# EAGLE design MOD-WiFi-ESP8266-DEV_Rev_B1 (EAGLE 4.16)
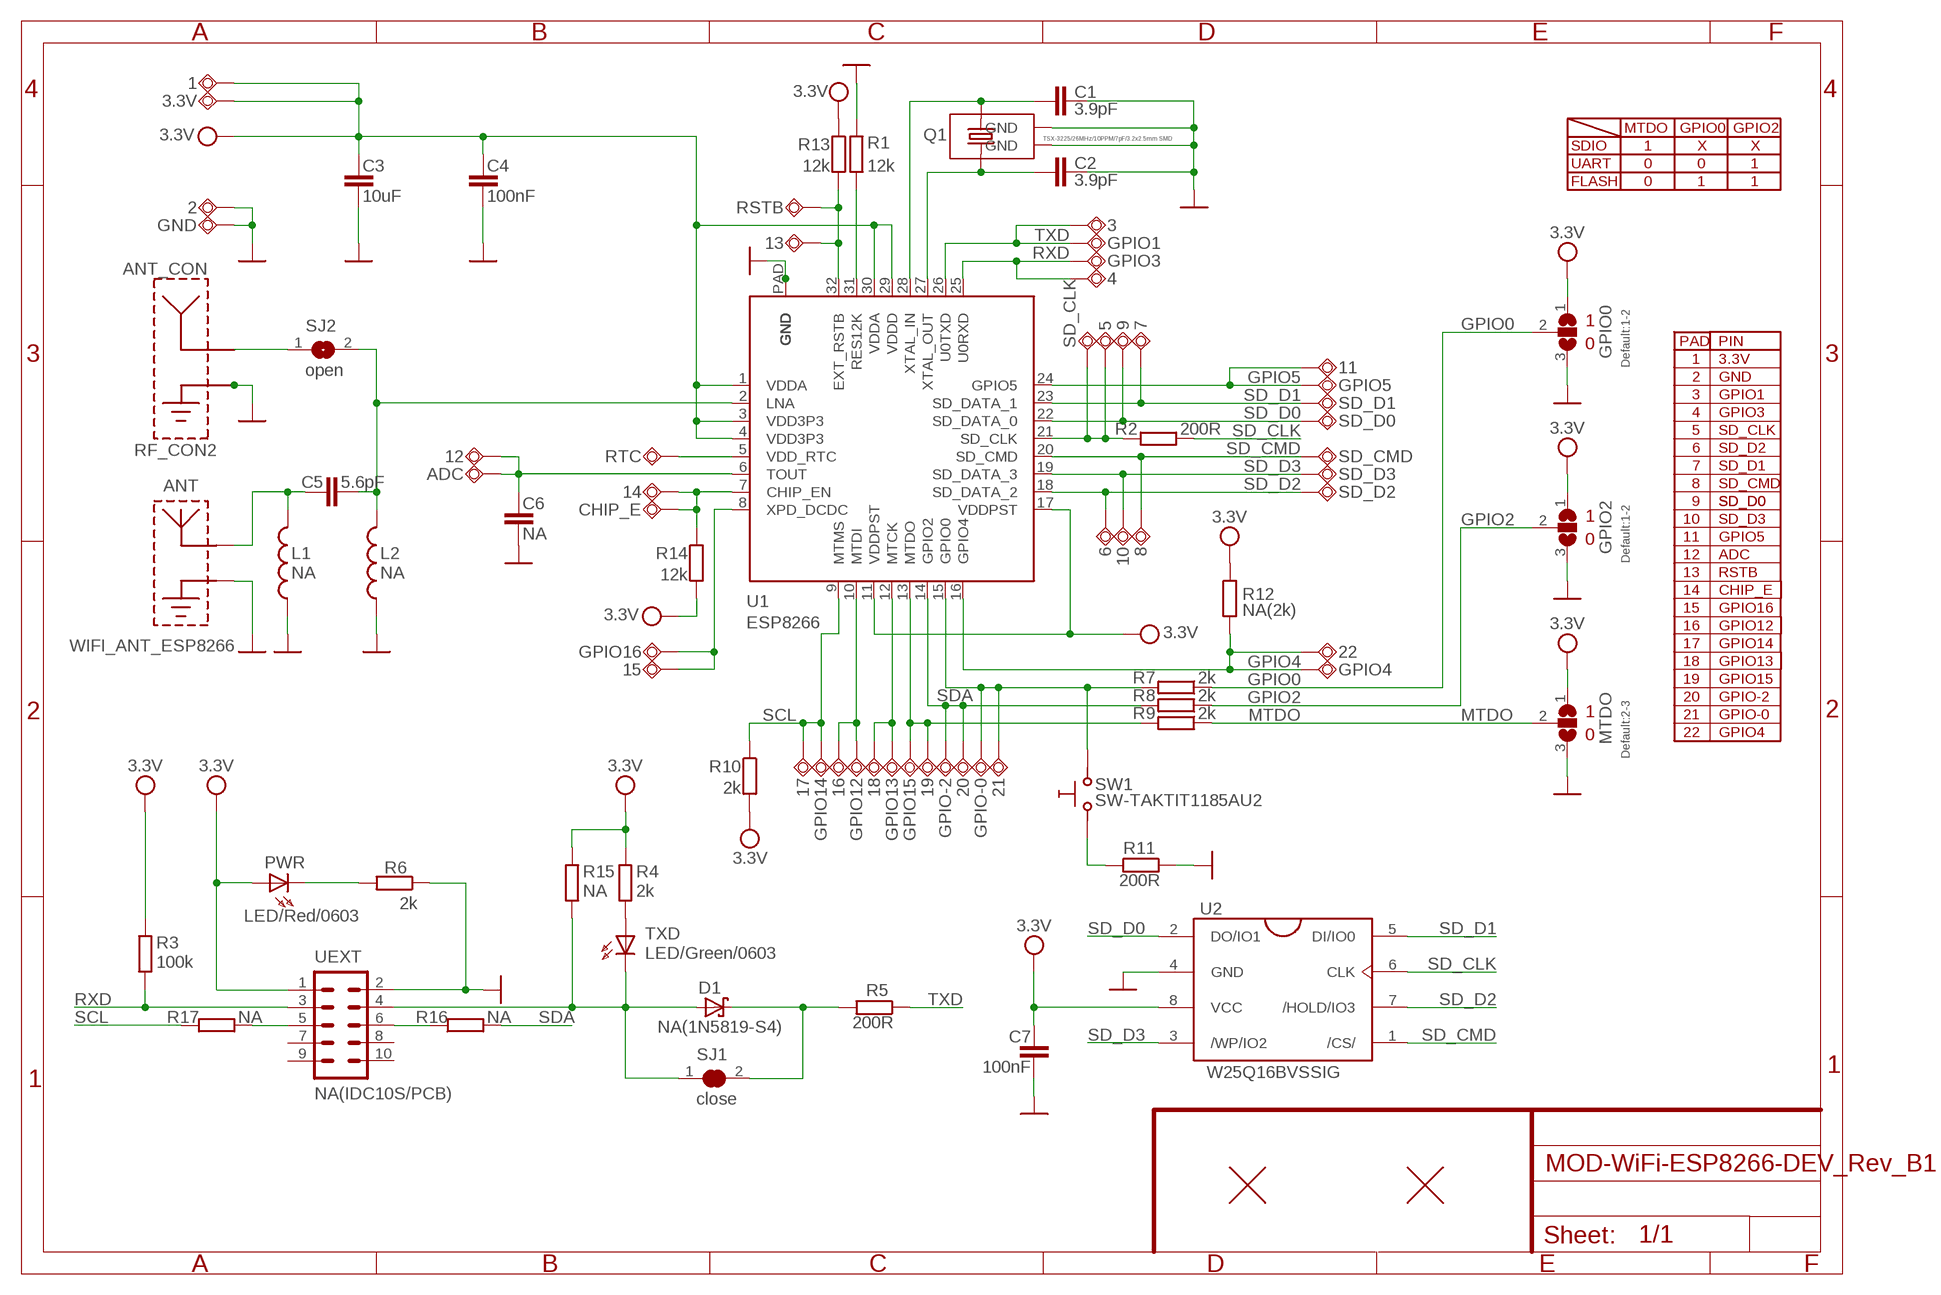
[diagram p0: schematic, sheet 1]

## Parts
1  TESTPAD8  [TESTPAD50/80]
2  TESTPAD8  [TESTPAD50/80]
3  TESTPAD8  [TESTPAD50/80]
3.3V  TESTPAD40/66  [TESTPAD40/66]
4  TESTPAD8  [TESTPAD50/80]
5  TESTPAD8  [TESTPAD50/80]
6  TESTPAD8  [TESTPAD50/80]
7  TESTPAD8  [TESTPAD50/80]
8  TESTPAD8  [TESTPAD50/80]
9  TESTPAD8  [TESTPAD50/80]
10  TESTPAD8  [TESTPAD50/80]
11  TESTPAD8  [TESTPAD50/80]
12  TESTPAD8  [TESTPAD50/80]
13  TESTPAD8  [TESTPAD50/80]
14  TESTPAD8  [TESTPAD50/80]
15  TESTPAD8  [TESTPAD50/80]
16  TESTPAD8  [TESTPAD50/80]
17  TESTPAD8  [TESTPAD50/80]
18  TESTPAD8  [TESTPAD50/80]
19  TESTPAD8  [TESTPAD50/80]
20  TESTPAD8  [TESTPAD50/80]
21  TESTPAD8  [TESTPAD50/80]
22  TESTPAD8  [TESTPAD50/80]
ADC  TESTPAD40/66  [TESTPAD40/66]
ANT  WIFI_ANT_ESP8266  [ESP8266_ANT]
ANT_CON  RF_CON2  [RF_CONNECTOR_I-PEX_NO_CREAM]
C1  3.9pF  C-EUC0402_TI  [C0402_TI]
C2  3.9pF  C-EUC0402_TI  [C0402_TI]
C3  10uF  C-EUC0603_DWS  [C0603_DWS]
C4  100nF  C-EUC0402_TI  [C0402_TI]
C5  5.6pF  C-EUC0402_TI  [C0402_TI]
C6  NA  C-EUC0402_TI  [C0402_TI]
C7  100nF  C-EUC0402_TI  [C0402_TI]
CHIP_E  TESTPAD40/66  [TESTPAD40/66]
D1  NA(1N5819-S4)  SCHOTKKY7.62SS-1N5819(S4SOD-123)  [SOD-123]
GND  TESTPAD40/66  [TESTPAD40/66]
GPIO0  Default:1-2  SJ2W4  [SJ_2_SMALLER]
GPIO1  TESTPAD40/66  [TESTPAD40/66]
GPIO2  Default:1-2  SJ2W4  [SJ_2_SMALLER]
GPIO3  TESTPAD40/66  [TESTPAD40/66]
GPIO4  TESTPAD40/66  [TESTPAD40/66]
GPIO5  TESTPAD40/66  [TESTPAD40/66]
GPIO12  TESTPAD40/66  [TESTPAD40/66]
GPIO13  TESTPAD40/66  [TESTPAD40/66]
GPIO14  TESTPAD40/66  [TESTPAD40/66]
GPIO15  TESTPAD40/66  [TESTPAD40/66]
GPIO16  TESTPAD40/66  [TESTPAD40/66]
GPIO-0  TESTPAD40/66  [TESTPAD40/66]
GPIO-2  TESTPAD40/66  [TESTPAD40/66]
L1  NA  L-USL0402_TI  [L0402_TI]
L2  NA  L-USL0402_TI  [L0402_TI]
MTDO  Default:2-3  SJ2W4  [SJ_2_SMALLER]
PWR  LED/Red/0603  LEDLED_0603  [LED_0603]
Q1  TSX-3225/26MHz/10PPM/7pF/3.2x2.5mm SMD  SMALL_SMD_CRYSTAL_1  [NX3225SA]
R1  12k  R-EU_R0402_TI  [R0402_TI]
R2  200R  R-EU_R0402_TI  [R0402_TI]
R3  100k  R-EU_R0402_TI  [R0402_TI]
R4  2k  R-EU_R0402_TI  [R0402_TI]
R5  200R  R-EU_R0402_TI  [R0402_TI]
R6  2k  R-EU_R0402_TI  [R0402_TI]
R7  2k  R-EU_R0402_TI  [R0402_TI]
R8  2k  R-EU_R0402_TI  [R0402_TI]
R9  2k  R-EU_R0402_TI  [R0402_TI]
R10  2k  R-EU_R0402_TI  [R0402_TI]
R11  200R  R-EU_R0402_TI  [R0402_TI]
R12  NA(2k)  R-EU_R0402_TI  [R0402_TI]
R13  12k  R-EU_R0402_TI  [R0402_TI]
R14  12k  R-EU_R0402_TI  [R0402_TI]
R15  NA  R-EU_R0402_TI  [R0402_TI]
R16  NA  R-EU_R0402_TI  [R0402_TI]
R17  NA  R-EU_R0402_TI  [R0402_TI]
RSTB  TESTPAD40/66  [TESTPAD40/66]
RTC  TESTPAD28/40  [TESPAD28/40]
SD_CLK  TESTPAD40/66  [TESTPAD40/66]
SD_CMD  TESTPAD40/66  [TESTPAD40/66]
SD_D0  TESTPAD40/66  [TESTPAD40/66]
SD_D1  TESTPAD40/66  [TESTPAD40/66]
SD_D2  TESTPAD40/66  [TESTPAD40/66]
SD_D3  TESTPAD40/66  [TESTPAD40/66]
SJ1  close  SJSJ_1_SMALLER_CLOSE_10MILS  [SJ_1_SMALLER_CLOSE_10MILS]
SJ2  open  SJSJ_SMALLER  [SJ_1_SMALLER]
SW1  SW-TAKTIT1185AU2  [IT1185AU2]
TXD  LED/Green/0603  LEDLED_0603  [LED_0603]
U1  ESP8266  [QFN32_PAD]
U2  W25Q16BVSSIG  [SO8_ATMEL_FLASH]
U$1  FIDUCIAL  [FIDUCIAL-1X3]
U$2  FIDUCIAL  [FIDUCIAL-1X3]
UEXT  NA(IDC10S/PCB)  ML10SMD_1  [ML10L_PADS_FEMAIL]

## Nets
GND: 2.P$1(PP) ANT.GND ANT_CON.1(GND_1) ANT_CON.2(GND_2) C1.1 C2.1 C3.2 C4.2 C6.2 C7.2 GND.P$1(PP) GPIO0.3 GPIO2.3 L1.1 L2.1 MTDO.3 Q1.NC_1(GND) Q1.NC_2(GND) R1.2 R6.1 R11.1 U1.P$1(GND) U1.P$2(GND) U1.P$3(GND) U1.P$4(GND) U1.P$5(GND) U1.P$6(GND) U1.P$7(GND) U1.P$8(GND) U1.P$9(GND) U1.PAD(GND) U2.4(GND) UEXT.2
GPIO0: GPIO0.2 R7.1
GPIO2: GPIO2.2 R8.1
GPIO4: 22.P$1(PP) GPIO4.P$1(PP) R12.2 U1.16(GPIO4)
GPIO5: 11.P$1(PP) GPIO5.P$1(PP) U1.24(GPIO5)
MTDO: MTDO.2 R9.1
N$1: D1.A R15.1 SJ1.1 TXD.C UEXT.4
N$2: R4.1 TXD.A
N$3: PWR.C R6.2
N$4: 21.P$1(PP) GPIO-0.P$1(PP) R7.2 SW1.2 U1.15(GPIO0)
N$5: ANT_CON.ANT SJ2.1
N$6: 19.P$1(PP) GPIO15.P$1(PP) R9.2 U1.13(MTDO)
N$7: R11.2 SW1.1
N$8: 15.P$1(PP) GPIO16.P$1(PP) U1.8(XPD_DCDC)
N$9: 16.P$1(PP) GPIO12.P$1(PP) U1.10(MTDI)
N$10: 18.P$1(PP) GPIO13.P$1(PP) U1.12(MTCK)
N$11: 14.P$1(PP) CHIP_E.P$1(PP) R14.1 U1.7(CHIP_EN)
N$12: C5.2 L2.2 SJ2.2 U1.2(LNA)
N$13: 13.P$1(PP) R13.2 RSTB.P$1(PP) U1.32(EXT_RSTB)
N$14: ANT.ANT C5.1 L1.2
N$15: D1.C R5.2 SJ1.2
N$16: R17.2 UEXT.5
N$17: R16.1 UEXT.6
N$18: 12.P$1(PP) ADC.P$1(PP) C6.1 U1.6(TOUT)
N$20: RTC.P$1(PP) U1.5(VDD_RTC)
N$21: C2.2 Q1.2 U1.27(XTAL_OUT)
N$22: R1.1 U1.31(RES12K)
N$23: C1.2 Q1.1 U1.28(XTAL_IN)
N$27: 5.P$1(PP) R2.2 SD_CLK.P$1(PP) U1.21(SD_CLK)
RXD: 4.P$1(PP) GPIO3.P$1(PP) R3.1 U1.25(U0RXD) UEXT.3
SCL: 17.P$1(PP) GPIO14.P$1(PP) R10.1 R17.1 U1.9(MTMS)
SD_CLK: R2.1 U2.6(CLK)
SD_CMD: 8.P$1(PP) SD_CMD.P$1(PP) U1.20(SD_CMD) U2.1(/CS/)
SD_D0: 9.P$1(PP) SD_D0.P$1(PP) U1.22(SD_DATA_0) U2.2(DO/IO1)
SD_D1: 7.P$1(PP) SD_D1.P$1(PP) U1.23(SD_DATA_1) U2.5(DI/IO0)
SD_D2: 6.P$1(PP) SD_D2.P$1(PP) U1.18(SD_DATA_2) U2.7(/HOLD/IO3)
SD_D3: 10.P$1(PP) SD_D3.P$1(PP) U1.19(SD_DATA_3) U2.3(/WP/IO2)
SDA: 20.P$1(PP) GPIO-2.P$1(PP) R8.2 R16.2 U1.14(GPIO2)
TXD: 3.P$1(PP) GPIO1.P$1(PP) R5.1 U1.26(U0TXD)
VCC: 1.P$1(PP) 3.3V.P$1(PP) C3.1 C4.1 C7.1 GPIO0.1 GPIO2.1 MTDO.1 PWR.A R3.2 R4.2 R10.2 R12.1 R13.1 R14.2 R15.2 U1.1(VDDA) U1.3(VDD3P3) U1.4(VDD3P3) U1.11(VDDPST) U1.17(VDDPST) U1.29(VDDD) U1.30(VDDA) U2.8(VCC) UEXT.1 ; supply symbol labelled 3.3V
Unconnected: UEXT.7 UEXT.8 UEXT.9 UEXT.10

## Notes on the sheet
- MTDO | GPIO0 | GPIO2
- SDIO | 1 | X | X
- UART | 0 | 0 | 1
- FLASH | 0 | 1 | 1
- 1
- 0 | PAD | PIN
- 1 | 3.3V
- 2 | GND
- 3 | GPIO1
- 4 | GPIO3
- 5 | SD_CLK
- 6 | SD_D2
- 7 | SD_D1
- 8 | SD_CMD
- 9 | SD_D0 | SD_D0
- 1 | 10 | SD_D3
- 0 | 11 | GPIO5
- 12 | ADC
- 13 | RSTB
- 14 | CHIP_E
- 15 | GPIO16
- 16 | GPIO12
- 17 | GPIO14
- 18 | GPIO13
- 19 | GPIO15
- 20 | GPIO-2
- 1 | 21 | GPIO-0
- 0 | 22 | GPIO4

## Library data of the parts
1-3 3.3V 4-22 ADC CHIP_E GND GPIO1 GPIO3-GPIO5 GPIO12-GPIO16 GPIO-0 GPIO-2 RSTB RTC SD_CLK SD_CMD SD_D0 SD_D1-SD_D3 = gogo:TESTPAD: drill 40mils, diameter 70mils
ANT = OLIMEX_ANT:WIFI_ANT_ESP8266
ANT_CON = OLIMEX_CONNECTORS:RF_CON
C1-C7 = rcl:C-EU: CAPACITOR, European symbol
D1 = gogo:SCHOTKKY7.62SS
GPIO0 GPIO2 MTDO = jumper:SJ2W: SMD solder JUMPER
L1 L2 = rcl:L-US: INDUCTOR, American symbol
PWR TXD = DOUBLE-SIDE:LED
Q1 = OLIMEX_DISCRET:SMALL_SMD_CRYSTAL
R1-R17 = rcl:R-EU_: RESISTOR, European symbol
SJ1 SJ2 = jumper:SJ: SMD solder JUMPER
SW1 = gogo:SW-TAKT
U1 = OLIMEX_IC:ESP8266
U2 = OLIMEX_IC:W25Q16BVSSIG
U$1 U$2 = SparkFunEagle-6-6-07:FIDUCIAL: Fiducial Alignment Points Various fiducial points for machine vision alignment.
UEXT = con-harting-ml:ML10: HARTING

## Board
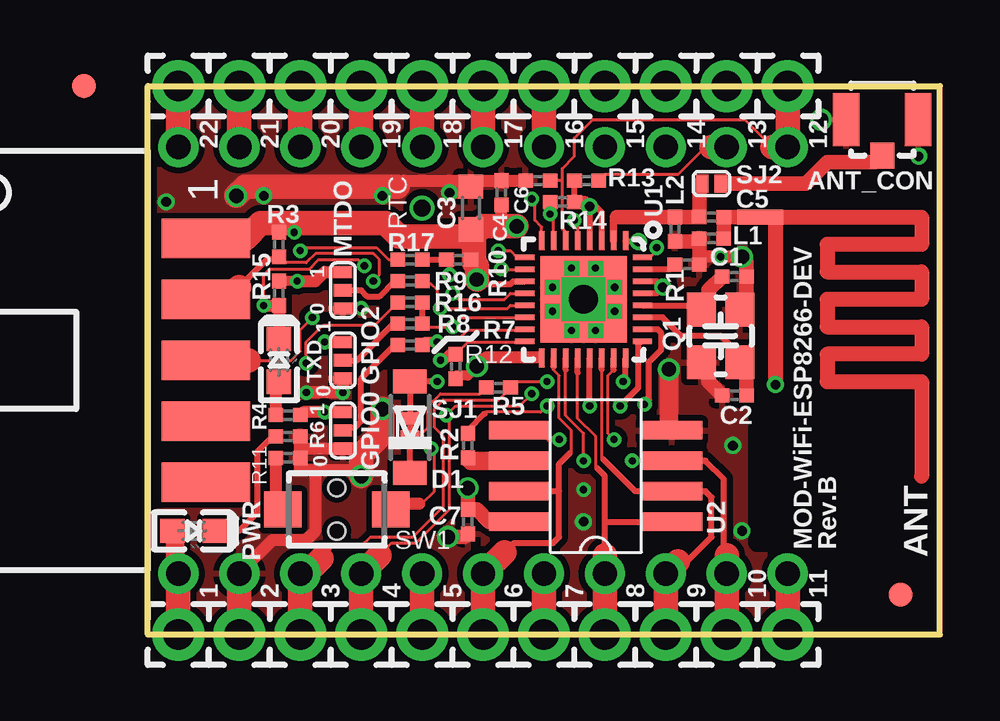
[diagram p1: board, top side]
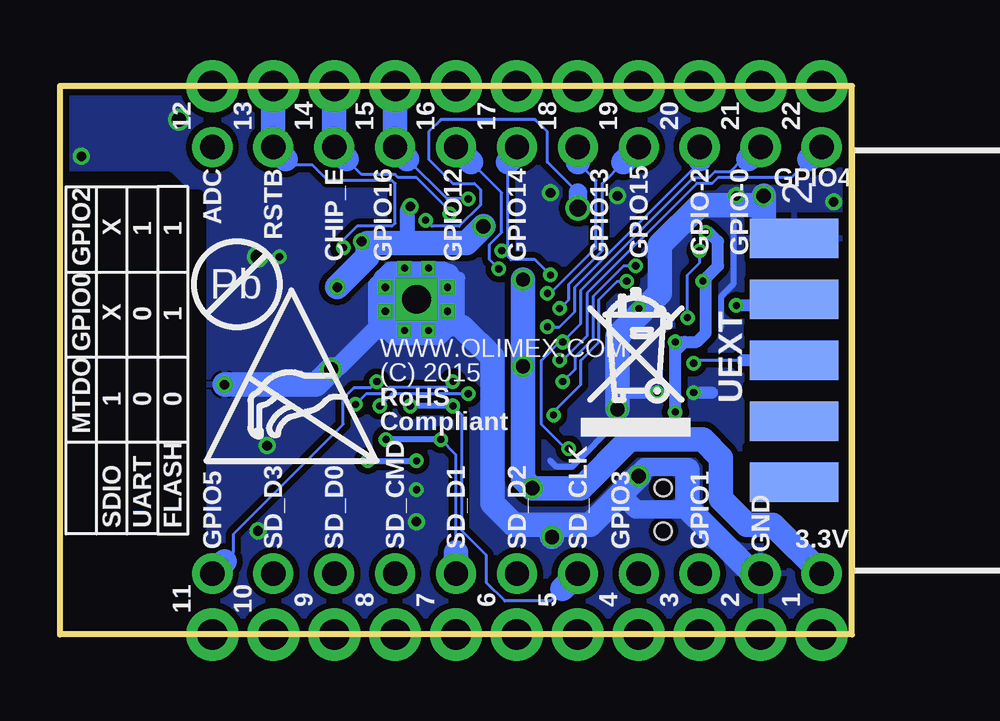
[diagram p2: board, bottom side, seen from below]

Size 33.02 x 22.86 mm. Coordinates in mm from the lower left corner, seen from the top.
Outline: 33.02,0 33.02,22.86 0,22.86 0,0 33.02,0
Copper layers (1+16): Top 0.035mm / dielectric 1.5mm / Bottom 0.035mm
Design rules "default": minimum track width 5mil, minimum drill 0.3mm, track to track 5mil, track to pad 5mil, pad to pad 5mil, via to via 5mil, smd to smd 1mil, copper to edge 5mil, drill to drill 8mil, minimum pad ring 6mil, minimum via ring 6mil, stop-mask expansion 2mil, vias tented up to drill 25mil, thermal gap 10mil
tRestrict: 109 lines
bRestrict: 99 lines

### Footprints (pad centres in the part's own frame; a part is rotated, then mirrored left to right if it is on the bottom)
TESTPAD50/80 = drill 1.27 pad 2.184 round: P$1 0,0
TESTPAD40/66 = drill 1.016 pad 1.676 round: P$1 0,0
ESP8266_ANT = smd 0.635 x 1.905: ANT -5.334,-3.302 | drill 0.4 pad 0.635 round: GND 1.651,-2.667
RF_CONNECTOR_I-PEX_NO_CREAM = smd 2.2 x 1.1: 1 0,1.5; 2 0,-1.5 | smd 1.1 x 1: ANT 1.5,0
C0402_TI = smd 0.61 x 0.584: 1 -0.508,0; 2 0.508,0
C0603_DWS = smd 1.016 x 1.016: 1 -0.889,0; 2 0.889,0
SOD-123 = smd 1 x 1.4: A 1.9,0; C -1.9,0
SJ_2_SMALLER = smd 0.508 x 0.762: 1 -0.762,0; 2 0,0; 3 0.762,0
L0402_TI = smd 0.61 x 0.584: 1 -0.508,0; 2 0.508,0
LED_0603 = smd 1.016 x 1.016: A 0.889,0; C -0.889,0
NX3225SA = smd 1.4 x 1.2: 1 -1.1,-0.8; 2 1.1,0.8; NC_1 1.1,-0.8; NC_2 -1.1,0.8
R0402_TI = smd 0.61 x 0.584: 1 -0.508,0; 2 0.508,0
TESPAD28/40 = drill 0.7 pad 1.016 round: P$1 0,0
SJ_1_SMALLER_CLOSE_10MILS = smd 0.508 x 0.762: 1 -0.381,0; 2 0.381,0
SJ_1_SMALLER = smd 0.508 x 0.762: 1 -0.381,0; 2 0.381,0
IT1185AU2 = smd 1.55 x 1.5: 1 -2.25,0; 2 2.25,0 | hole 0.7: 0,-0.9; 0,0.9
QFN32_PAD = smd 0.8 x 0.23: 1 -2.45,1.75; 2 -2.45,1.25; 3 -2.45,0.75; 4 -2.45,0.25; 5 -2.45,-0.25; 6 -2.45,-0.75; 7 -2.45,-1.25; 8 -2.45,-1.75; 17 2.45,-1.75; 18 2.45,-1.25; 19 2.45,-0.75; 20 2.45,-0.25; 21 2.45,0.25; 22 2.45,0.75; 23 2.45,1.25; 24 2.45,1.75 | smd 0.23 x 0.8: 9 -1.75,-2.45; 10 -1.25,-2.45; 11 -0.75,-2.45; 12 -0.25,-2.45; 13 0.25,-2.45; 14 0.75,-2.45; 15 1.25,-2.45; 16 1.75,-2.45; 25 1.75,2.45; 26 1.25,2.45; 27 0.75,2.45; 28 0.25,2.45; 29 -0.25,2.45; 30 -0.75,2.45; 31 -1.25,2.45; 32 -1.75,2.45 | drill 1.2 pad 1.422 square: P$1 0,0 | drill 0.3 pad 0.4 square: P$2 0.5,1.3; P$3 -0.5,1.3; P$4 -1.3,0.5; P$5 -1.3,-0.5; P$6 -0.5,-1.3; P$7 0.5,-1.3; P$8 1.3,-0.5; P$9 1.3,0.5 | smd 3.6 x 3.6: PAD 0,0
SO8_ATMEL_FLASH = smd 0.762 x 2.54: 1 -1.905,-3.175; 2 -0.635,-3.175; 3 0.635,-3.175; 4 1.905,-3.175; 5 1.905,3.175; 6 0.635,3.175; 7 -0.635,3.175; 8 -1.905,3.175
FIDUCIAL-1X3 = smd 1 x 1: 1 0,0
ML10L_PADS_FEMAIL = smd 1.651 x 3.683 bottom: 1 -5.08,-3.429; 3 -2.54,-3.429; 5 0,-3.429; 7 2.54,-3.429; 9 5.08,-3.429 | smd 1.651 x 3.683: 2 -5.08,-3.429; 4 -2.54,-3.429; 6 0,-3.429; 8 2.54,-3.429; 10 5.08,-3.429

### Placement (x,y rotation side)
1  1.27,0 0 top
2  3.81,0 0 top
3  6.35,0 0 top
3.3V  1.27,2.54 90 top
4  8.89,0 0 top
5  11.43,0 180 top
6  13.97,0 180 top
7  16.51,0 180 top
8  19.05,0 180 top
9  21.59,0 180 top
10  24.13,0 180 top
11  26.67,0 0 top
12  26.67,22.86 0 top
13  24.13,22.86 0 top
14  21.59,22.86 0 top
15  19.05,22.86 0 top
16  16.51,22.86 180 top
17  13.97,22.86 0 top
18  11.43,22.86 180 top
19  8.89,22.86 0 top
20  6.35,22.86 180 top
21  3.81,22.86 180 top
22  1.27,22.86 180 top
ADC  26.67,20.32 90 top
ANT  28.83,12.06 270 top
ANT_CON  30.61,21.46 270 top
C1  24.45,14.92 180 top
C2  24.45,9.97 0 top
C3  13.46,17.78 90 top
C4  14.73,18.41 90 top
C5  23.5,17.4 180 top
C6  16.26,18.92 180 top
C7  13.34,4.7 270 top
CHIP_E  21.59,20.32 0 top
D1  10.92,8.64 90 top
GND  3.81,2.54 90 top
GPIO0  8.13,8.51 270 top
GPIO1  6.35,2.54 90 top
GPIO2  8.13,11.43 270 top
GPIO3  8.89,2.54 90 top
GPIO4  1.27,20.32 270 top
GPIO5  26.67,2.54 90 top
GPIO12  16.51,20.32 270 top
GPIO13  11.43,20.32 270 top
GPIO14  13.97,20.32 90 top
GPIO15  8.89,20.32 90 top
GPIO16  19.05,20.32 90 top
GPIO-0  3.81,20.32 270 top
GPIO-2  6.35,20.32 270 top
L1  23.5,16.51 0 top
L2  21.97,16.89 90 top
MTDO  8.13,14.35 270 top
PWR  1.91,4.32 180 top
Q1  23.88,12.45 270 top
R1  22.48,15.43 0 top
R2  13.34,7.87 90 top
R3  5.46,16.26 90 top
R4  5.84,9.14 0 top
R5  14.61,10.29 180 top
R6  5.84,8.26 180 top
R7  10.92,12.06 0 top
R8  10.92,12.95 0 top
R9  10.92,14.73 0 top
R10  12.95,15.62 0 top
R11  5.84,7.37 180 top
R12  12.83,11.18 90 top
R13  18.29,18.92 0 top
R14  17.27,18.03 0 top
R15  5.46,14.22 90 top
R16  10.92,13.84 0 top
R17  10.92,15.62 180 top
RSTB  24.13,20.32 0 top
RTC  11.43,17.78 0 top
SD_CLK  11.43,2.54 270 top
SD_CMD  19.05,2.54 270 top
SD_D0  21.59,2.54 270 top
SD_D1  16.51,2.54 270 top
SD_D2  13.97,2.54 270 top
SD_D3  24.13,2.54 270 top
SJ1  10.92,8.64 270 top
SJ2  23.5,18.8 180 top
SW1  7.87,5.21 0 top
TXD  5.46,11.43 270 top
U1  18.16,13.97 270 top
U2  18.67,6.6 90 top
U$1  -2.67,22.86 180 top
U$2  31.37,1.65 180 top
U$4  [ESD_SYMBOL]  26.92,7.24 0 bottom
U$6  [PB_SMALL]  25.65,14.61 180 bottom
U$7  [RECYCLE_BIN1/8]  11.3,8.26 0 bottom
UEXT  -1.02,11.43 270 bottom

### Tracks (layer width: path | path; a pad name or v marks a point on that pad's centre or on a via)
GND  (via drill 0.3, 0.4, 0.6)
  Top 0.254: 23.37,11.35 Q1.NC_1
  Top 0.508: 13.46,18.92 C4.2 C6.2 | v24.77,15.75 22.99,15.75 | v8.89,13.59 MTDO.3 | GPIO2.3 v8.13,10.08 v6.6,10.08 | 8.89,7.49 8.64,7.75 GPIO0.3 6.35,7.75 | v8.89,6.6 8.89,6.86 6.99,6.86 | 6.35,7.75 R11.1 6.35,6.86 6.99,6.86 | 6.35,7.75 R6.1 | 10.41,18.67 10.67,18.92 12.57,18.92 | 12.57,18.92 v12.57,18.41 13.46,18.41 C3.2 13.46,18.92 | 12.57,18.92 13.46,18.92 | 9.78,18.67 v9.78,18.29 | GND.P$1 5.21,3.94 6.6,3.94 6.99,4.32 6.99,6.86
  Top 0.61: 22.99,16.38 L2.1 | R1.2 22.99,15.75 22.99,16.38 | 22.99,16.38 L1.1 | Q1.NC_2 24.96,13.83 C1.1 24.96,15.56 v24.77,15.75 | C2.1 23.37,10.54 23.37,11.35 | v12.51,4.06 13.21,4.06 C7.2
  Top 0.762: v21.72,11.05 21.72,8.51 U2.4
  Top 1.016: v3.68,18.29 4.06,18.67 9.78,18.67 10.41,18.67 | 2.P$1 GND.P$1 | v8.89,6.6 8.89,7.49 9.78,8.38 v9.78,9.4
  Bottom 0.254: v9.78,9.4 9.78,8.89 11.68,6.99 12.32,6.99 12.57,7.24 | 4.95,17.91 4.95,14.61 5.46,14.1 5.46,12.83
  Bottom 0.508: 19.18,15.18 19.18,15.05 | 18.66,15.18 U1.P$4 | 17.66,15.18 U1.P$5 | 16.38,14.86 16.38,13.08 17.14,12.32 19.18,12.32 19.94,13.08 19.94,14.61 19.75,14.8 19.43,14.8 | 9.78,10.08 v8.13,10.08 | v6.6,10.08 5.84,10.08 | 8.89,13.34 v8.89,13.59
  Bottom 0.762: 6.86,6.86 6.86,6.99 8.64,6.99 8.89,6.73 v8.89,6.6 | 19.18,15.18 18.66,15.18 17.66,15.18 17.08,15.18 16.86,14.96 | 16.26,12.83 17.02,12.83 | 19.15,12.67 19.91,12.67 21.4,11.18 21.59,11.18 v21.72,11.05 | 6.86,5.46 7.11,5.21 9.02,5.21 9.65,5.84
  Bottom 1.016: 6.86,6.86 6.86,5.46 6.86,5.27 4.13,2.54 GND.P$1 | v8.89,6.6 9.65,5.84 10.92,4.57 12.51,4.57 | 19.18,15.05 19.43,14.8 19.46,14.77 U1.P$3 U1.P$2 19.46,12.98 19.15,12.67 U1.P$9 U1.P$8 17.18,12.67 17.02,12.83 16.86,12.98 U1.P$7 16.86,13.97 | 16.86,14.96 U1.P$6 16.86,13.97 | 16.86,13.97 U1.P$1 | 16.26,12.83 14.99,11.56 14.99,5.46 14.1,4.57 12.51,4.57 | v21.72,11.05 22.35,10.41 ANT.GND | UEXT.2 3.68,16.51 3.68,17.91 | 3.68,17.91 v3.68,18.29 | 12.51,4.57 v12.51,4.06 | v9.78,9.4 9.78,10.08 9.78,12.45 8.89,13.34 8,14.22 8,16.26 6.35,17.91 4.95,17.91 3.68,17.91
  other vias: 23.88,15.75 18.16,6.03 24.77,4.32 24.38,7.87 18.16,4.7 0.76,18.03 4.83,18.29 28.07,21.46 32.13,19.94
  pour Top (isolate 0.254): -2.54,-2.54 -2.54,25.4 35.56,25.4 35.56,-2.54
  pour Bottom (isolate 0.254): -5.08,-5.08 -5.08,27.94 38.1,27.94 38.1,-5.08
GPIO0
  Top 0.254: GPIO0.2 8.26,8.64 8.64,8.64 8.89,8.89 8.89,10.67 10.29,12.06 R7.1
GPIO2
  Top 0.254: R8.1 10.24,12.95 8.71,11.43 GPIO2.2
GPIO4  (via drill 0.3)
  Top 0.127: U1.16 15.68,12.19 13.34,12.19 R12.2
  Top 0.406: v12.19,11.43 12.32,11.43 12.57,11.68 R12.2
  Top 1.016: GPIO4.P$1 22.P$1
  Bottom 0.127: v12.19,11.43 12.06,11.43 11.05,12.45 11.05,14.22 6.48,18.8 5.84,18.8 5.59,19.05 2.54,19.05 1.78,19.81
  Bottom 1.016: GPIO4.P$1 1.78,19.81
GPIO5  (via drill 0.3)
  Top 0.254: v19.81,10.54 19.91,10.64 U1.24
  Top 1.016: 11.P$1 GPIO5.P$1
  Bottom 0.127: v19.81,10.54 20.07,10.29 20.77,10.29 21.21,9.84 21.21,8.76 25.78,4.19 25.78,3.43 26.16,3.05
  Bottom 1.016: GPIO5.P$1 26.16,3.05
MTDO
  Top 0.254: R9.1 10.29,14.73 9.65,14.1 9.14,14.1 8.89,14.35 MTDO.2
N$1  (via drill 0.3)
  Top 0.127: v9.02,15.37 8.76,15.62 7.11,15.62 6.73,15.24 5.08,15.24 4.83,14.99 v4.83,13.72
  Top 0.254: SJ1.1 D1.A v12.06,10.54
  Top 0.508: TXD.C R15.1 v4.83,13.72
  Bottom 0.127: v12.06,10.54 11.56,11.05 11.56,11.56 10.79,12.32 10.79,14.1 9.53,15.37 v9.02,15.37
  Bottom 0.254: UEXT.4 2.67,13.72
  Bottom 0.508: 2.67,13.72 v4.83,13.72
N$2
  Top 0.508: TXD.A 5.33,10.54 R4.1
N$3
  Top 0.254: PWR.C 3.81,4.32 4.57,5.08 4.57,7.62 5.08,8.13 5.21,8.13 R6.2
N$4  (via drill 0.3)
  Top 0.127: v12.06,12.19 12.19,12.32 12.95,12.32 13.34,12.7 15.69,12.7 U1.15 | 11.3,5.46 11.43,5.46 11.94,5.97 11.94,7.62 v11.81,7.75
  Top 0.406: R7.2 11.56,12.19 v12.06,12.19
  Top 0.508: SW1.2 10.12,5.46 11.3,5.46
  Top 1.016: GPIO-0.P$1 21.P$1
  Bottom 0.127: 4.32,19.81 4.57,19.81 5.08,19.3 5.71,19.3 5.97,19.05 6.6,19.05 11.3,14.35 11.3,12.95 v12.06,12.19 12.19,12.19 12.95,11.43 12.95,8.76 11.94,7.75 v11.81,7.75
  Bottom 1.016: 4.32,19.81 GPIO-0.P$1
N$5
  Top 0.508: SJ2.1 24,18.8
  Top 0.61: 24,18.8 27.43,18.8 28.32,19.68 30.33,19.68 ANT_CON.ANT
N$6  (via drill 0.3)
  Top 0.127: R9.2 11.56,14.61 11.81,14.61 12.06,14.35 12.06,13.72 v12.19,13.59 14.99,13.59 15.11,13.72 U1.13
  Top 1.016: GPIO15.P$1 19.P$1
  Bottom 0.127: v12.19,13.59 11.81,13.97 11.81,14.61 10.41,16 10.41,18.8 9.53,19.68
  Bottom 1.016: 9.53,19.68 GPIO15.P$1
N$7
  Top 0.508: SW1.1 5.33,5.21 R11.2
N$8  (via drill 0.3)
  Top 0.127: v16,18.16 16.13,18.03 16.13,17.27 16.41,16.99 U1.8
  Bottom 0.127: v16,18.16 16.89,18.16 18.54,19.81
  Bottom 1.016: 18.54,19.81 GPIO16.P$1 15.P$1
N$9  (via drill 0.3)
  Top 0.127: v14.73,15.24 14.75,15.22 U1.10
  Top 1.016: GPIO12.P$1 16.P$1
  Bottom 0.127: v14.73,15.24 15.11,15.62 15.11,16.26 14.61,16.76 14.61,18.41 15.88,19.68
  Bottom 1.016: 15.88,19.68 GPIO12.P$1
N$10  (via drill 0.3)
  Top 0.127: U1.12 15.11,14.22 14.86,13.97 12.95,13.97 v12.7,14.22
  Top 1.016: GPIO13.P$1 18.P$1
  Bottom 0.127: v12.7,14.22 12.57,14.22 10.67,16.13 10.67,18.92 11.43,19.68
  Bottom 1.016: 11.43,19.68 GPIO13.P$1
N$11  (via drill 0.3)
  Top 0.127: U1.7 16.91,17.38 v16.76,17.53
  Top 0.508: v16.76,17.53 R14.1
  Bottom 0.127: v16.76,17.53 16.76,17.65 18.16,19.05 18.92,19.05 19.05,19.18 20.45,19.18 21.08,19.81
  Bottom 1.016: 21.08,19.81 CHIP_E.P$1 14.P$1
N$12
  Top 0.305: U1.2 19.41,17.25 19.56,17.4
  Top 0.508: 22.99,18.8 SJ2.2
  Top 0.61: 19.56,17.4 L2.2 C5.2 22.99,18.8
N$13  (via drill 0.3)
  Top 0.127: U1.32 20.93,15.72 21.21,16 v21.21,16.13 | R13.2 19.05,19.18 22.1,19.18 23.24,20.32 23.5,20.32
  Top 1.016: RSTB.P$1 23.5,20.32
  Bottom 0.127: v21.21,16.13 21.21,16.45 20.64,17.02 19.18,17.02 19.05,17.14 19.05,18.8 19.18,18.92 21.84,18.92 22.48,19.56 23.37,19.56 23.62,19.81
  Bottom 1.016: 23.62,19.81 RSTB.P$1 13.P$1
N$14
  Top 0.61: L1.2 C5.1 ANT.ANT
N$15
  Top 0.127: 11.3,8.26 11.68,8.64 11.68,9.53 12.19,10.03 13.84,10.03 R5.2
  Top 0.254: D1.C SJ1.2
  Top 0.406: SJ1.2 11.3,8.26
N$16  (via drill 0.3)
  Top 0.127: R17.2 10.03,15.62 9.53,16.13 6.48,16.13 v6.35,16 | v6.86,13.21 6.35,12.7 6.35,11.81 5.97,11.43 4.19,11.43
  Top 1.016: UEXT.5 4.19,11.43
  Bottom 0.127: v6.35,16 6.35,15.49 6.86,14.99 v6.86,13.21
N$17  (via drill 0.3)
  Top 0.127: R16.1 9.46,12.89 7.3,12.89 6.6,12.19 v6.6,11.3
  Bottom 0.127: 4.57,11.43 6.48,11.43 v6.6,11.3
  Bottom 0.508: UEXT.6 4.57,11.43
N$18
  Top 0.127: U1.6 17.41,16.78 17.27,16.92 17.27,18.92 | 26.04,20.32 24.89,21.46 18.54,21.46 17.78,20.7 17.78,19.94 17.27,19.43 17.27,18.92 | 17.27,18.92 C6.1
  Top 1.016: 26.04,20.32 ADC.P$1 12.P$1
N$20  (via drill 0.3)
  Top 0.127: U1.5 17.91,17.14 v17.78,17.27
  Bottom 0.127: v17.78,17.27 17.53,17.02 16.38,17.02 15.49,17.91 15.49,18.54 15.75,18.8 16.64,18.8 17.65,19.81 17.65,20.95 17.14,21.46 13.21,21.46 12.7,20.95 12.7,19.68 11.43,18.41
  Bottom 0.762: RTC.P$1 11.43,18.41
N$21
  Top 0.254: U1.27 21.45,13.22 22.23,12.45 23.88,12.45 24.68,11.65 Q1.2
  Top 0.61: C2.2 24.96,11.07 Q1.2
N$22
  Top 0.254: U1.31 21.76,15.22 R1.1
N$23
  Top 0.254: 23.37,13.55 Q1.1 | U1.28 23.37,13.72
  Top 0.61: 23.37,13.55 23.37,13.72 23.37,14.35 C1.2
N$27  (via drill 0.3)
  Top 0.127: v18.41,9.53 | 13.34,8.51 R2.2 | 14.03,9.21 14.1,9.27 16.38,9.27 v16.64,9.53
  Top 0.254: v18.41,9.53 U1.21 | 14.03,9.21 13.34,8.51
  Top 1.016: 5.P$1 SD_CLK.P$1
  Bottom 0.127: v16.64,9.53 16.26,9.14 16.26,4.32 15.24,3.3 15.24,2.16 14.48,1.4 12.57,1.4 12.06,1.91
  Bottom 0.254: v16.64,9.53 v18.41,9.53
  Bottom 1.016: SD_CLK.P$1 12.06,1.91
RXD  (via drill 0.3)
  Top 0.127: v9.4,14.73 9.65,14.99 9.65,15.62 9.4,15.88 6.99,15.88 6.6,15.49 5.71,15.49 R3.1 | v16,10.03 15.49,9.53 12.83,9.53 v12.45,9.14 12.57,9.02 12.57,5.21 11.18,3.81 10.16,3.81 9.65,3.3
  Top 0.254: R3.1 5.33,15.62 4.95,15.62 3.81,14.48 | v19.68,9.53 20.45,10.29 20.45,12.22 U1.25
  Top 1.016: 3.81,14.48 3.3,13.97 UEXT.3 | 9.65,3.3 GPIO3.P$1 4.P$1
  Bottom 0.127: v9.4,14.73 9.78,14.73 10.54,13.97 10.54,12.19 11.3,11.43 11.3,10.41 12.45,9.27 v12.45,9.14 | v16,10.03 19.18,10.03 v19.68,9.53
SCL  (via drill 0.3)
  Top 0.127: v14.61,16 15.11,16 15.39,15.72 U1.9
  Top 0.254: v12.57,14.99 12.57,15.49 R10.1 R17.1
  Top 1.016: GPIO14.P$1 17.P$1
  Bottom 0.127: 14.35,19.68 14.35,16.26 v14.61,16 14.22,15.62 13.21,15.62 v12.57,14.99
  Bottom 1.016: 14.35,19.68 13.97,20.07 GPIO14.P$1
SD_CLK
  Top 0.61: R2.1 13.46,7.24
  Top 0.762: 13.46,7.24 U2.6
SD_CMD
  Top 0.127: 18.73,6.92 18.67,6.99 18.67,8.26 17.91,9.01 17.91,10.92
  Top 0.254: 17.91,10.92 U1.20 | 19.05,4.7 19.05,6.6 18.73,6.92 | 19.05,4.7 U2.1 | 19.05,3.3 19.05,4.7
  Top 1.016: 19.05,3.3 SD_CMD.P$1 8.P$1
SD_D0
  Top 0.127: 18.91,11.06 18.92,11.05 18.92,7.37 18.99,7.3
  Top 0.254: 18.91,11.06 U1.22 | 18.99,7.3 20.32,5.97 U2.2 23.24,5.97 23.5,5.71 23.5,4.06 22.48,3.05 22.1,3.05
  Top 1.016: 22.1,3.05 SD_D0.P$1 9.P$1
SD_D1  (via drill 0.3)
  Top 0.127: v19.43,8.13 19.18,8.38 19.18,10.79 19.41,11.03
  Top 0.254: 19.41,11.03 U1.23 | v17.14,8.13 16.76,8.13 16.38,8.51 U2.5
  Top 1.016: 7.P$1 SD_D1.P$1
  Bottom 0.127: 16.51,3.43 16.51,7.49 v17.14,8.13
  Bottom 0.254: v17.14,8.13 v19.43,8.13
  Bottom 1.016: SD_D1.P$1 16.51,3.43
SD_D2
  Top 0.127: 17.59,7.56 17.65,7.62 17.65,8.51 17.14,9.02 17.14,10.79 16.91,11.03 16.91,11.16
  Top 0.254: 16.91,11.16 U1.18 | 17.14,5.97 U2.7 | 17.14,5.97 17.14,7.11 17.59,7.56 | 14.86,3.43 15.24,3.81 16.89,3.81 17.14,4.06 17.14,5.97
  Top 1.016: 14.86,3.43 SD_D2.P$1 6.P$1
SD_D3  (via drill 0.3)
  Top 0.127: v18.16,7.24 18.16,8.38 17.41,9.13 17.41,11.04
  Top 0.254: 17.41,11.04 U1.19 | v20.19,7.24 U2.3 23.24,7.24 24,6.48 24,3.43 24.13,3.3
  Top 1.016: 24.13,3.3 SD_D3.P$1 10.P$1
  Bottom 0.254: v20.19,7.24 v18.16,7.24
SDA  (via drill 0.3)
  Top 0.127: R8.2 11.56,12.83 v12.7,12.83 13.08,13.21 15.7,13.21 U1.14
  Top 0.254: R16.2 R8.2
  Top 1.016: GPIO-2.P$1 20.P$1
  Bottom 0.127: v12.7,12.83 12.19,12.83 11.56,13.46 11.56,14.48 6.35,19.68 6.35,19.81
  Bottom 1.016: 6.35,19.81 GPIO-2.P$1
TXD  (via drill 0.3)
  Top 0.127: 7.24,3.17 7.75,3.68 8.89,3.68 9.27,4.06 11.05,4.06 12.32,5.33 12.32,8.26 11.94,8.64 11.94,9.4 12.32,9.78 14.61,9.78 R5.1 15.37,10.54 v16.64,10.54
  Top 0.254: U1.26 21.25,12.72 21.4,12.57 21.4,11.87 20.89,11.37 20.89,9.78 v20.7,9.59
  Top 1.016: 7.24,3.17 6.48,2.41 GPIO1.P$1 3.P$1
  Bottom 0.127: v20.7,9.59 20.26,10.03 19.56,10.03 19.3,10.29 16.89,10.29 v16.64,10.54
VCC  (via drill 0.3, 0.4, 0.6)
  Top 0.254: v18.41,17.84 U1.4 | v18.41,17.84 18.67,17.84 18.91,17.6 U1.3 | v20.45,16.38 19.91,16.38 U1.1 | U1.30 21.22,14.72 v21.46,14.48 21.2,14.22 U1.29 | 16.26,11.56 16.41,11.56 U1.17 | v13.72,14.8 13.91,14.61 15.11,14.61 15.23,14.72 U1.11 | v18.41,17.84 18.41,17.4 | R14.2 R13.1
  Top 0.406: v6.22,14.73 R15.2 | R12.1 12.83,10.79 13.34,10.79 v13.72,11.18
  Top 0.508: v13.72,11.18 14.1,11.56 16.26,11.56 | v6.1,16.76 6.1,17.14 | 5.46,17.14 R3.2 | 14.73,17.02 C4.1 | GPIO0.1 v7.37,9.27 6.48,9.27 R4.2 | v7.37,12.19 GPIO2.1 | v6.22,14.73 6.99,14.73 7.37,15.11 MTDO.1 | 13.59,15.62 R10.2 | v18.41,17.84 18.22,18.03 R14.2
  Top 0.61: U2.8 14.22,4.7 13.72,5.21 C7.1 v13.34,6.1
  Top 0.762: PWR.A 1.14,4.19 1.14,2.67 3.3V.P$1
  Top 1.016: v13.72,14.8 13.72,15.37 13.59,15.49 13.59,15.62 13.59,16.59 | 13.59,16.89 13.84,16.89 13.97,17.02 14.73,17.02 v15.37,17.02 | 13.59,16.89 C3.1 | 13.59,16.59 13.59,16.89 | 13.59,16.59 10.46,16.59 9.91,17.14 6.1,17.14 5.46,17.14 4.7,17.14 4.06,16.51 UEXT.1 | 1.P$1 3.3V.P$1
  Bottom 0.508: 20.19,16.32 20.26,16.38 v20.45,16.38 | 7.37,11.81 v7.37,9.27 7.37,8.13 | 7.37,11.81 v7.37,12.19 6.99,12.19 | v6.1,16.76 5.97,16.76 5.59,16.38 5.59,15.37 v6.22,14.73 6.1,14.73 6.1,12.57 6.48,12.19 6.99,12.19 | 7.37,11.81 6.99,12.19
  Bottom 0.635: 18.41,16.32 18.53,16.43 18.53,17.73 v18.41,17.84
  Bottom 1.016: 3.3V.P$1 3.3,4.57 4.38,4.57 5.46,5.65 5.46,7.37 6.22,8.13 7.37,8.13 9.27,8.13 11.3,6.1 v13.34,6.1 13.72,6.48 v13.72,11.18 v13.72,14.8 | v15.37,17.02 16.07,16.32 18.41,16.32 20.19,16.32 20.19,15.75 v21.46,14.48

### Text on the board
Top: 66 errors top
Bottom: 27 errors bottom
bPlace: 1 | 1 | X | GPIO2 | 1 | 0 | X | GPIO0 | 0 | 0 | 1 | MTDO | FLASH | UART | SDIO
tNames: 1 | 0 | 1 | 0 | 1 | 0 | MOD-WiFi-ESP8266-DEV | Rev.B | 93 errors total
bNames: WWW.OLIMEX.COM | (C) 2015 | RoHS | Compliant
201bmp: C:/YASSEN_ON_C-YASSEN-REBORN/TASKS/MOD-nRF8001===P/Nordic_NRF8001/nRF8001-Gerber Files/with DCDC/!PICLIST-0909+++.BMP